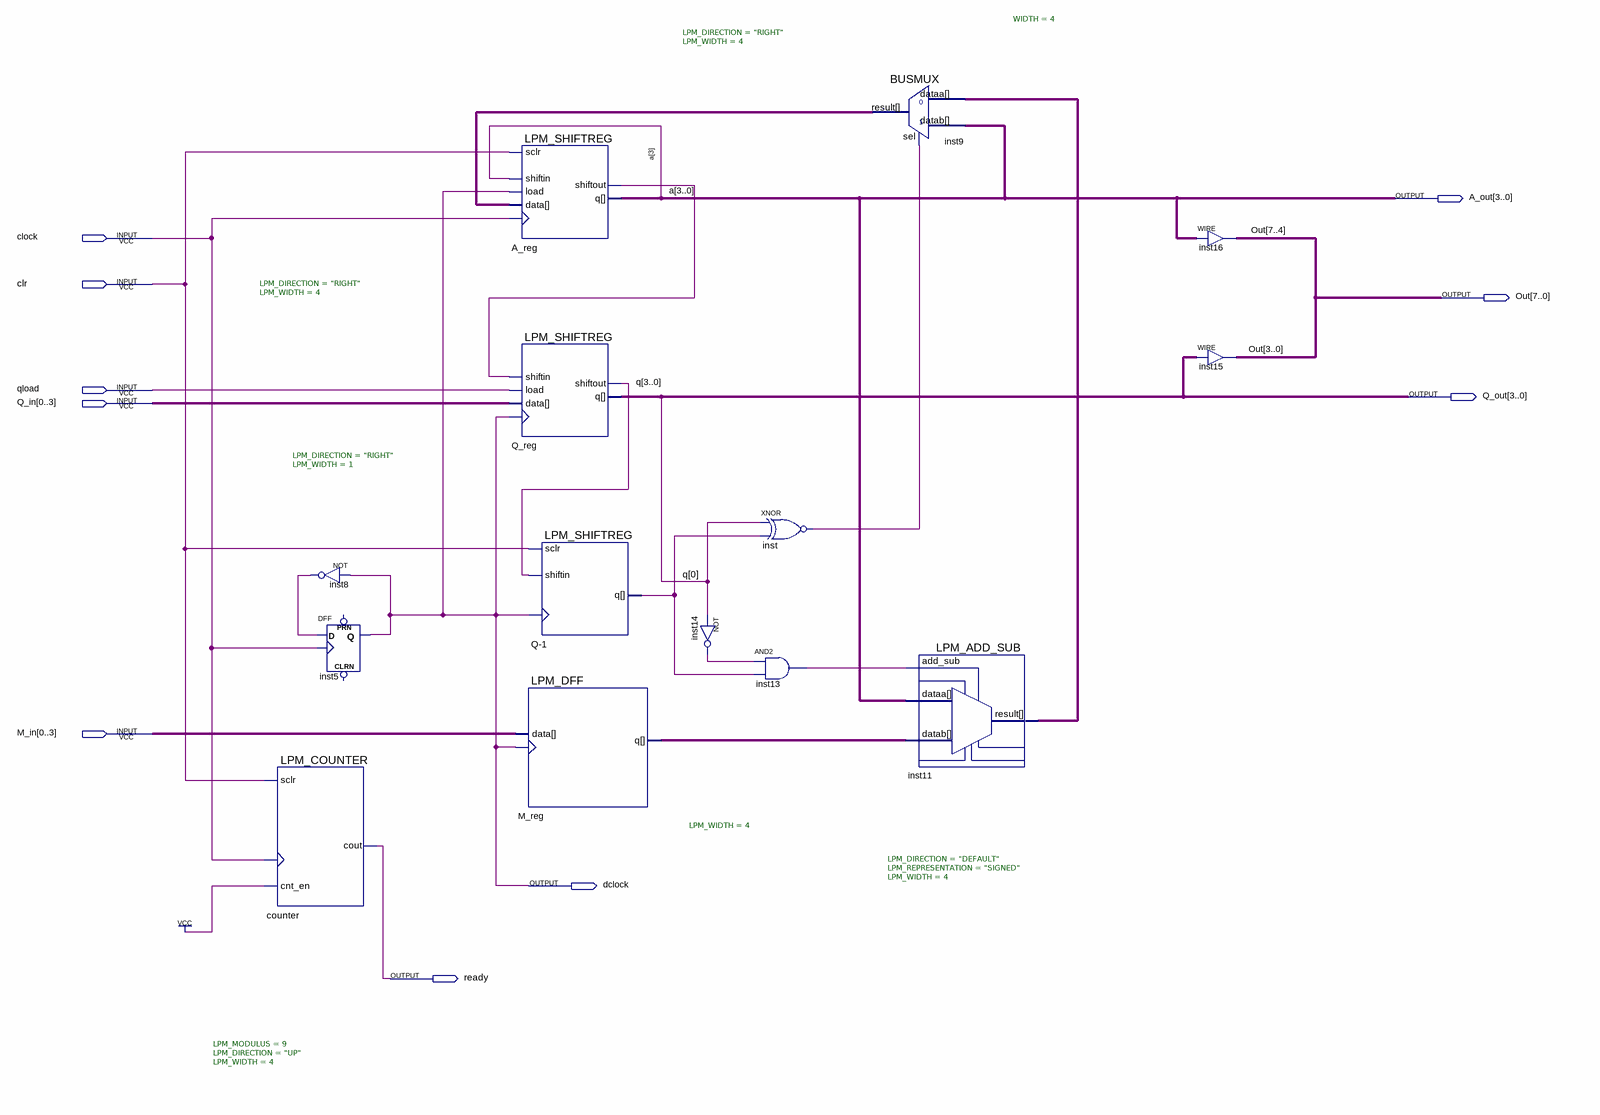
[diagram p0: schematic sheet]
// Quartus schematic lab2_upd.bdf as structural Verilog: 14 symbols, 10 pins
module lab2_upd (
  input  clock,
  input  clr,
  input  qload,
  input  [0:3] Q_in,
  input  [0:3] M_in,
  output [3:0] A_out,
  output [7:0] Out,
  output [3:0] Q_out,
  output dclock,
  output ready
);

  wire A_reg_shiftout, inst8_out, inst13_out, inst14_out, inst_out, Q_1_q, Q_reg_shiftout;
  wire [3:0] inst9_result, inst11_result, M_reg_q;

  LPM_COUNTER #(.LPM_MODULUS(9), .LPM_DIRECTION("UP"), .LPM_WIDTH(4)) counter (
    .clock(clock), .cnt_en(1'b1), .sclr(clr), .cout(ready));
  not inst8 (inst8_out, dclock);
  DFF inst5 (.CLK(clock), .D(inst8_out), .Q(dclock));  // open: CLRN, PRN
  LPM_SHIFTREG #(.LPM_DIRECTION("RIGHT"), .LPM_WIDTH(4)) A_reg (
    .clock(clock), .data(inst9_result), .load(dclock), .sclr(clr), .shiftin(A_out[3]), .q(A_out),
    .shiftout(A_reg_shiftout));
  LPM_SHIFTREG #(.LPM_DIRECTION("RIGHT"), .LPM_WIDTH(4)) Q_reg (
    .clock(dclock), .data(Q_in), .load(qload), .shiftin(A_reg_shiftout), .q(Q_out), .shiftout(Q_reg_shiftout));
  LPM_SHIFTREG #(.LPM_DIRECTION("RIGHT"), .LPM_WIDTH(1)) \Q-1  (
    .clock(dclock), .sclr(clr), .shiftin(Q_reg_shiftout), .q(Q_1_q));
  LPM_DFF #(.LPM_WIDTH(4)) M_reg (.clock(dclock), .data(M_in), .q(M_reg_q));
  not inst14 (inst14_out, Q_out[0]);
  xnor inst (inst_out, Q_out[0], Q_1_q);
  and inst13 (inst13_out, inst14_out, Q_1_q);
  BUSMUX #(.WIDTH(4)) inst9 (.datab(A_out), .sel(inst_out), .dataa(inst11_result), .result(inst9_result));
  LPM_ADD_SUB #(.LPM_DIRECTION("DEFAULT"), .LPM_REPRESENTATION("SIGNED"), .LPM_WIDTH(4)) inst11 (
    .add_sub(inst13_out), .dataa(A_out), .datab(M_reg_q), .result(inst11_result));
  assign Out[7:4] = A_out;  // WIRE inst16
  assign Out[3:0] = Q_out;  // WIRE inst15

  // Other names for the same wires on the sheet: a[3:0] = A_out; q[3:0] = Q_out
endmodule
